# EAGLE design UBTB_original (EAGLE 9.4.2)
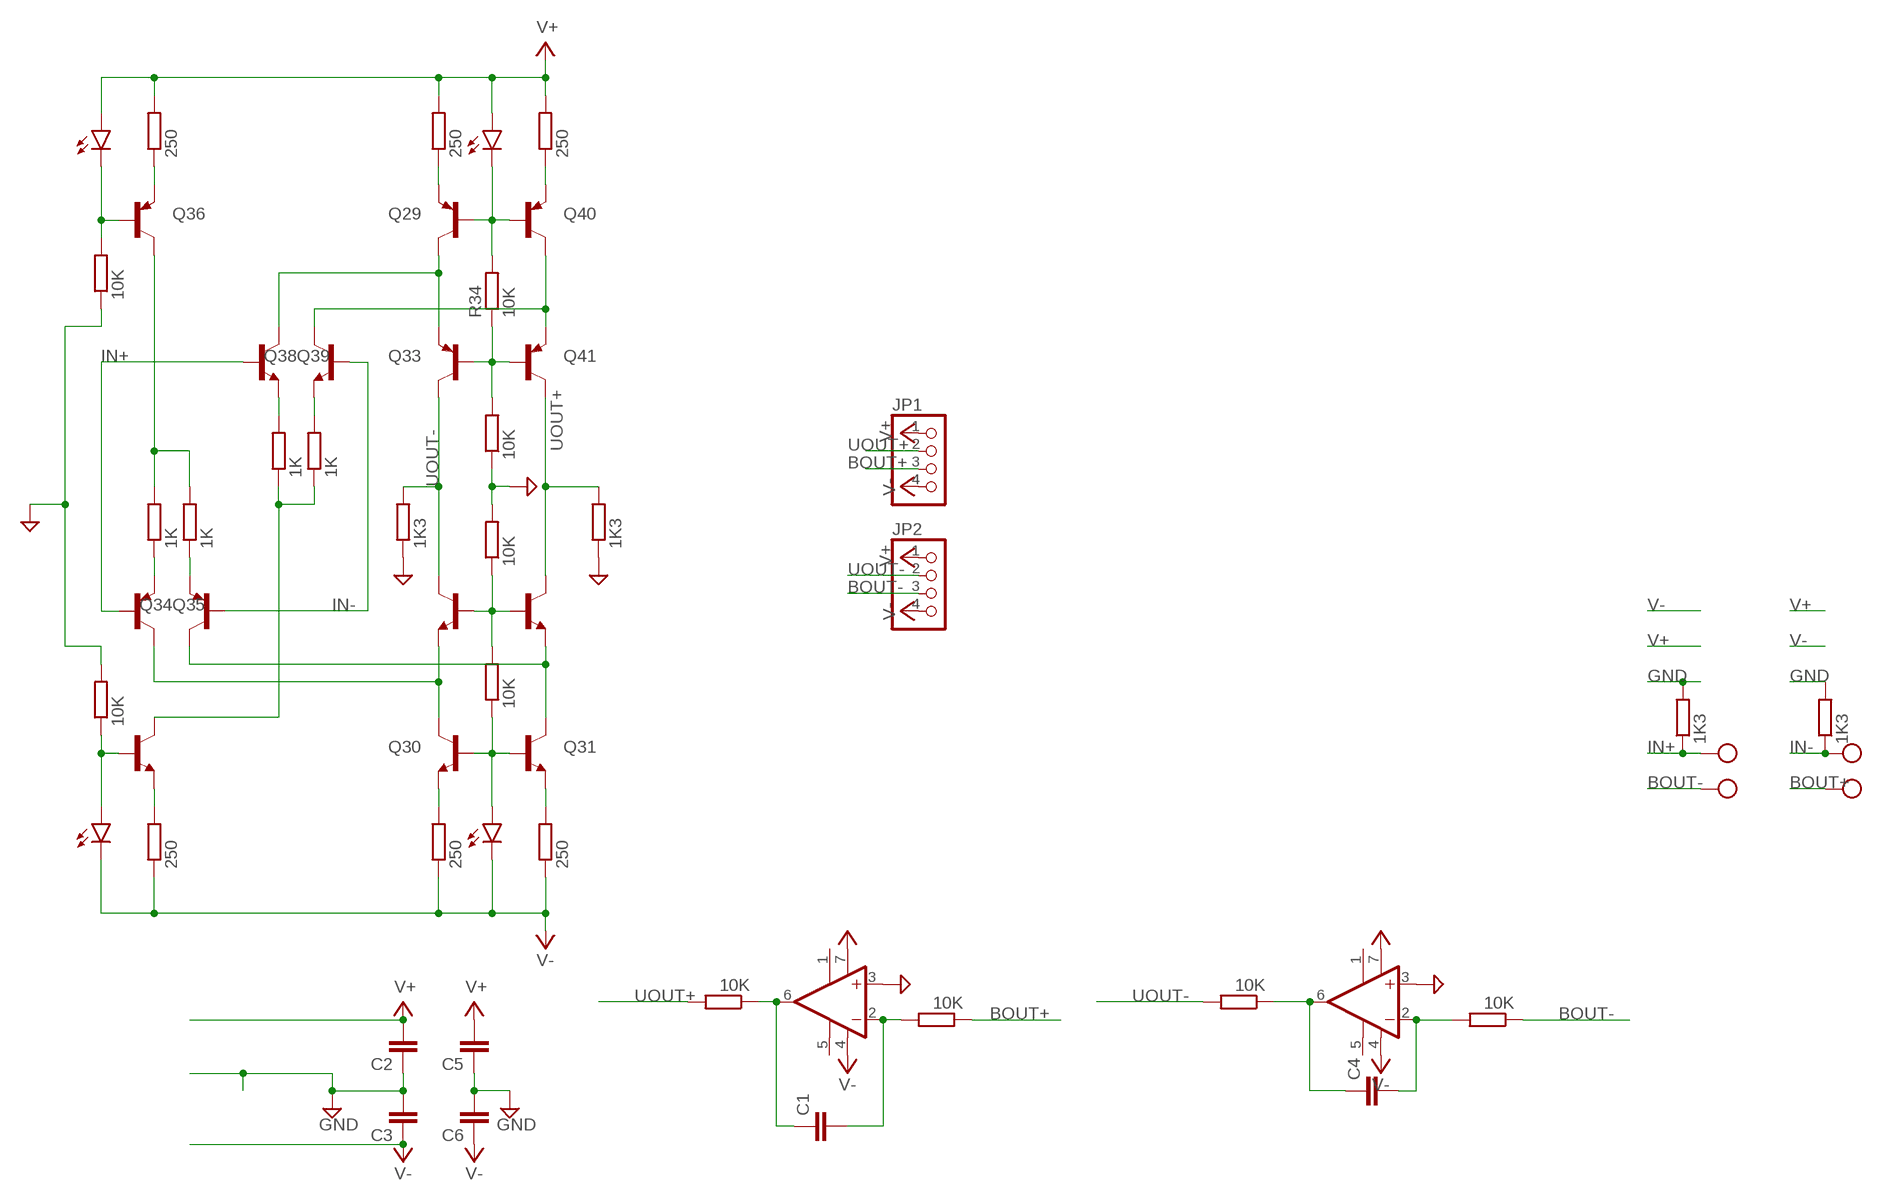
[diagram p0: schematic, sheet 1]

## Parts
C1  C-EUC1206  [C1206]
C2  C-EUC0805  [C0805]
C3  C-EUC0805  [C0805]
C4  C-EUC1206  [C1206]
C5  C-EUC0805  [C0805]
C6  C-EUC0805  [C0805]
IC1  OPA627U  [SO08]
IC2  OPA627U  [SO08]
JP1  PINHD-1X4  [1X04]
JP2  PINHD-1X4  [1X04]
LED1  LEDCHIPLED_1206  [CHIPLED_1206]
LED2  LEDCHIPLED_1206  [CHIPLED_1206]
LED3  LEDCHIPLED_1206  [CHIPLED_1206]
LED4  LEDCHIPLED_1206  [CHIPLED_1206]
Q26  BC847CSMD  [SOT23]
Q29  BC857CSMD  [SOT23-BEC]
Q30  BC847CSMD  [SOT23]
Q31  BC847CSMD  [SOT23]
Q32  BC847CSMD  [SOT23]
Q33  BC857CSMD  [SOT23-BEC]
Q34  BC857CSMD  [SOT23-BEC]
Q35  BC857CSMD  [SOT23-BEC]
Q36  BC857CSMD  [SOT23-BEC]
Q37  BC847CSMD  [SOT23]
Q38  BC847CSMD  [SOT23]
Q39  BC847CSMD  [SOT23]
Q40  BC857CSMD  [SOT23-BEC]
Q41  BC857CSMD  [SOT23-BEC]
R1  1K3  R-EU_MELF0204W  [MINI_MELF-0204W]
R2  1K3  R-EU_MELF0204W  [MINI_MELF-0204W]
R16  10K  R-EU_MELF0204W  [MINI_MELF-0204W]
R17  10K  R-EU_MELF0204W  [MINI_MELF-0204W]
R22  250  R-EU_MELF0204W  [MINI_MELF-0204W]
R23  250  R-EU_MELF0204W  [MINI_MELF-0204W]
R29  10K  R-EU_MELF0204W  [MINI_MELF-0204W]
R32  10K  R-EU_MELF0204W  [MINI_MELF-0204W]
R33  10K  R-EU_MELF0204W  [MINI_MELF-0204W]
R34  10K  R-EU_MELF0204W  [MINI_MELF-0204W]
R35  250  R-EU_MELF0204W  [MINI_MELF-0204W]
R36  250  R-EU_MELF0204W  [MINI_MELF-0204W]
R37  1K3  R-EU_MELF0204W  [MINI_MELF-0204W]
R38  1K3  R-EU_MELF0204W  [MINI_MELF-0204W]
R39  1K  R-EU_MELF0204W  [MINI_MELF-0204W]
R40  1K  R-EU_MELF0204W  [MINI_MELF-0204W]
R41  1K  R-EU_MELF0204W  [MINI_MELF-0204W]
R42  1K  R-EU_MELF0204W  [MINI_MELF-0204W]
R43  250  R-EU_MELF0204W  [MINI_MELF-0204W]
R44  250  R-EU_MELF0204W  [MINI_MELF-0204W]
R45  10K  R-EU_MELF0204W  [MINI_MELF-0204W]
R46  10K  R-EU_MELF0204W  [MINI_MELF-0204W]
R48  10K  R-EU_MELF0204W  [MINI_MELF-0204W]
R51  10K  R-EU_MELF0204W  [MINI_MELF-0204W]
X3  CON-PHOENIX-508_MKDSN1,5/2-5,08  [CON-PHOENIX-508_MKDSN1,5/2-5,08]
X4  CON-PHOENIX-508_MKDSN1,5/2-5,08  [CON-PHOENIX-508_MKDSN1,5/2-5,08]

## Nets
BOUT+: JP1.3 R17.1 X4.2
BOUT-: JP2.3 R48.1 X3.2
GND: C2.1 C3.2 C5.1 C6.2 IC1.3(+IN) IC2.3(+IN) R1.2 R2.2 R32.2 R33.1 R37.1 R38.1 R45.1 R46.2
IN+: Q35.B Q39.1(B) R1.1 X3.1
IN-: Q34.B Q38.1(B) R2.1 X4.1
N$1: C4.1 IC2.6(OUT) R51.1
N$3: C4.2 IC2.2(-IN) R48.2
N$19: C1.2 IC1.2(-IN) R17.2
N$22: C1.1 IC1.6(OUT) R16.1
N$93: Q30.2(E) R22.2
N$94: Q31.2(E) R23.2
N$95: Q31.3(C) Q32.2(E) Q34.C
N$96: Q30.3(C) Q35.C Q37.2(E)
N$97: LED1.A Q30.1(B) Q31.1(B) R29.1
N$98: Q32.1(B) Q37.1(B) R29.2 R32.1
N$101: Q33.B Q41.B R33.2 R34.1
N$102: Q29.C Q33.E Q39.3(C)
N$103: LED2.C Q29.B Q40.B R34.2
N$104: Q38.3(C) Q40.C Q41.E
N$105: Q29.E R35.1
N$106: Q40.E R36.1
N$108: LED3.C Q36.B R45.2
N$109: Q36.E R43.1
N$110: Q36.C R41.2 R42.2
N$111: Q34.E R42.1
N$112: Q35.E R41.1
N$115: Q39.2(E) R39.2
N$116: Q38.2(E) R40.2
N$117: Q26.3(C) R39.1 R40.1
N$118: Q26.2(E) R44.2
N$119: LED4.A Q26.1(B) R46.1
UOUT+: JP1.2 Q32.3(C) Q41.C R16.2 R38.2
UOUT-: JP2.2 Q33.C Q37.3(C) R37.2 R51.2
V+: C2.2 C5.2 IC1.7(V+) IC2.7(V+) JP1.1 JP2.1 LED2.A LED3.A R35.2 R36.2 R43.2
V-: C3.1 C6.1 IC1.4(V-) IC2.4(V-) JP1.4 JP2.4 LED1.C LED4.C R22.1 R23.1 R44.1
Unconnected: IC1.1(TRIM1) IC1.5(TRIM2) IC2.1(TRIM1) IC2.5(TRIM2)

## Library data of the parts
C1-C6 = Vwvwbg:C-EU: CAPACITOR, European symbol
IC1 IC2 = burr-brown:OPA627: Difet(R) Operational Amplifiers Precision, High-Speed; MF: TEXAS INSTRUMENTS; MPN: OPA627AU; OC_FARNELL: 1207067; OC_NEWARK: 30C4516
JP1 JP2 = pinhead:PINHD-1X4: PIN HEADER
LED1-LED3 = led:LED: LED OSRAM: - CHIPLED LG R971, LG N971, LY N971, LG Q971, LY Q971, LO R971, LY R971 LH N974, LH R974 LS Q976, LO Q976, LY Q976 LO Q996 - Hyper CHIPLED LW Q18S LB Q993, LB Q99A, LB R99A - SideLED LS A670, LO A670, LY A670, LG A670, LP A670 LB A673, LV A673, LT A673, LW A673 LH A674 LY A675 LS A676, LA A676, LO A676, LY A676, LW A676 LS A679, LY A679, LG A679 - Hyper Micro SIDELED® LS Y876, LA Y876, LO Y876, LY Y876 LT Y87S - SmartLED LW L88C, LW L88S LB L89C, LB L89S, LG L890 LS L89K, LO L89K, LY L89K LS L896, LA L896, LO L896, LY L896 - TOPLED LS T670, LO T670, LY T670, LG T670, LP T670 LSG T670, LSP T670, LSY T670, LOP T670, LYG T670 LG T671, LOG T671, LSG T671 LB T673, LV T673, LT T673, LW T673 LH T674 LS T676, LA T676, LO T676, LY T676, LB T676, LH T676, LSB T676, LW T676 LB T67C, LV T67C, LT T67C, LS T67K, LO T67K, LY T67K, LW E67C LS E67B, LA E67B, LO E67B, LY E67B, LB E67C, LV E67C, LT E67C LW T67C LS T679, LY T679, LG T679 LS T770, LO T770, LY T770, LG T770, LP T770 LB T773, LV T773, LT T773, LW T773 LH T774 LS E675, LA E675, LY E675, LS T675 LS T776, LA T776, LO T776, LY T776, LB T776 LHGB T686 LT T68C, LB T68C - Hyper Mini TOPLED® LB M676 - Mini TOPLED Santana® LG M470 LS M47K, LO M47K, LY M47K Source: http://www.osram.convergy.de LUXEON: - LUMILED® LXK2-PW12-R00, LXK2-PW12-S00, LXK2-PW14-U00, LXK2-PW14-V00 LXK2-PM12-R00, LXK2-PM12-S00, LXK2-PM14-U00 LXK2-PE12-Q00, LXK2-PE12-R00, LXK2-PE12-S00, LXK2-PE14-T00, LXK2-PE14-U00 LXK2-PB12-K00, LXK2-PB12-L00, LXK2-PB12-M00, LXK2-PB14-N00, LXK2-PB14-P00, LXK2-PB14-Q00 LXK2-PR12-L00, LXK2-PR12-M00, LXK2-PR14-Q00, LXK2-PR14-R00 LXK2-PD12-Q00, LXK2-PD12-R00, LXK2-PD12-S00 LXK2-PH12-R00, LXK2-PH12-S00 LXK2-PL12-P00, LXK2-PL12-Q00, LXK2-PL12-R00 Source: www.luxeon.com KINGBRIGHT: KA-3528ASYC Source: www.kingbright.com
LED4 = led:LED: LED OSRAM: - CHIPLED LG R971, LG N971, LY N971, LG Q971, LY Q971, LO R971, LY R971 LH N974, LH R974 LS Q976, LO Q976, LY Q976 LO Q996 - Hyper CHIPLED LW Q18S LB Q993, LB Q99A, LB R99A - SideLED LS A670, LO A670, LY A670, LG A670, LP A670 LB A673, LV A673, LT A673, LW A673 LH A674 LY A675 LS A676, LA A676, LO A676, LY A676, LW A676 LS A679, LY A679, LG A679 - Hyper Micro SIDELED® LS Y876, LA Y876, LO Y876, LY Y876 LT Y87S - SmartLED LW L88C, LW L88S LB L89C, LB L89S, LG L890 LS L89K, LO L89K, LY L89K LS L896, LA L896, LO L896, LY L896 - TOPLED LS T670, LO T670, LY T670, LG T670, LP T670 LSG T670, LSP T670, LSY T670, LOP T670, LYG T670 LG T671, LOG T671, LSG T671 LB T673, LV T673, LT T673, LW T673 LH T674 LS T676, LA T676, LO T676, LY T676, LB T676, LH T676, LSB T676, LW T676 LB T67C, LV T67C, LT T67C, LS T67K, LO T67K, LY T67K, LW E67C LS E67B, LA E67B, LO E67B, LY E67B, LB E67C, LV E67C, LT E67C LW T67C LS T679, LY T679, LG T679 LS T770, LO T770, LY T770, LG T770, LP T770 LB T773, LV T773, LT T773, LW T773 LH T774 LS E675, LA E675, LY E675, LS T675 LS T776, LA T776, LO T776, LY T776, LB T776 LHGB T686 LT T68C, LB T68C - Hyper Mini TOPLED® LB M676 - Mini TOPLED Santana® LG M470 LS M47K, LO M47K, LY M47K Source: http://www.osram.convergy.de LUXEON: - LUMILED® LXK2-PW12-R00, LXK2-PW12-S00, LXK2-PW14-U00, LXK2-PW14-V00 LXK2-PM12-R00, LXK2-PM12-S00, LXK2-PM14-U00 LXK2-PE12-Q00, LXK2-PE12-R00, LXK2-PE12-S00, LXK2-PE14-T00, LXK2-PE14-U00 LXK2-PB12-K00, LXK2-PB12-L00, LXK2-PB12-M00, LXK2-PB14-N00, LXK2-PB14-P00, LXK2-PB14-Q00 LXK2-PR12-L00, LXK2-PR12-M00, LXK2-PR14-Q00, LXK2-PR14-R00 LXK2-PD12-Q00, LXK2-PD12-R00, LXK2-PD12-S00 LXK2-PH12-R00, LXK2-PH12-S00 LXK2-PL12-P00, LXK2-PL12-Q00, LXK2-PL12-R00 Source: www.luxeon.com KINGBRIGHT: KA-3528ASYC Source: www.kingbright.com; SPICEPREFIX: D
Q26 Q30-Q32 Q37-Q39 = transistor-npn:BC847*: NPN Transistor; SPICEPREFIX: Q
Q29 Q33-Q36 Q40 Q41 = transistor-pnp:BC857*: PNP Transistror; SPICEPREFIX: Q
R1 R2 R16 R17 R22 R23 R29 R32-R43 R45 R46 R48 R51 = Vwvwbg:R-EU_: RESISTOR, European symbol
R44 = Vwvwbg:R-EU_: RESISTOR, European symbol; SPICEPREFIX: R
X3 X4 = Vwvwbg:CON-PHOENIX-508_MKDSN1,5/2-5,08: MKDSN 1,5/ 2-5,08 Printklemme Nennstrom: 13,5 A Nennspannung: 250 V Rastermaß: 5,08 mm Polzahl: 2 Anschlussart: Schraubanschluss Montage: Löten Anschlussrichtung Leiter/Platine: 0 ° Artikelnummer: 1729128 Source: http://eshop.phoenixcontact.com .. 1729128.pdf

## Board
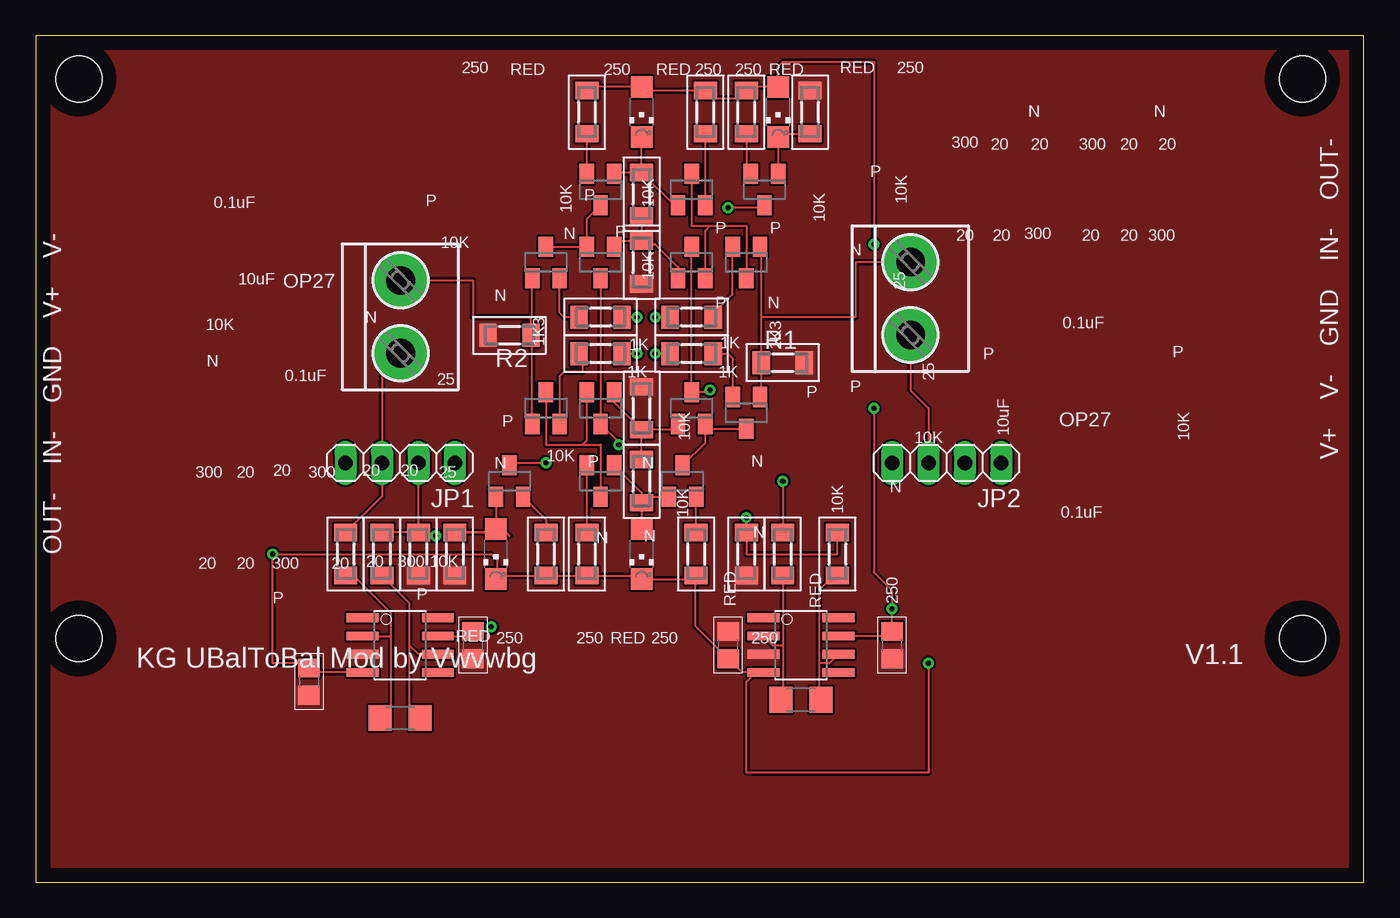
[diagram p1: board, top side]
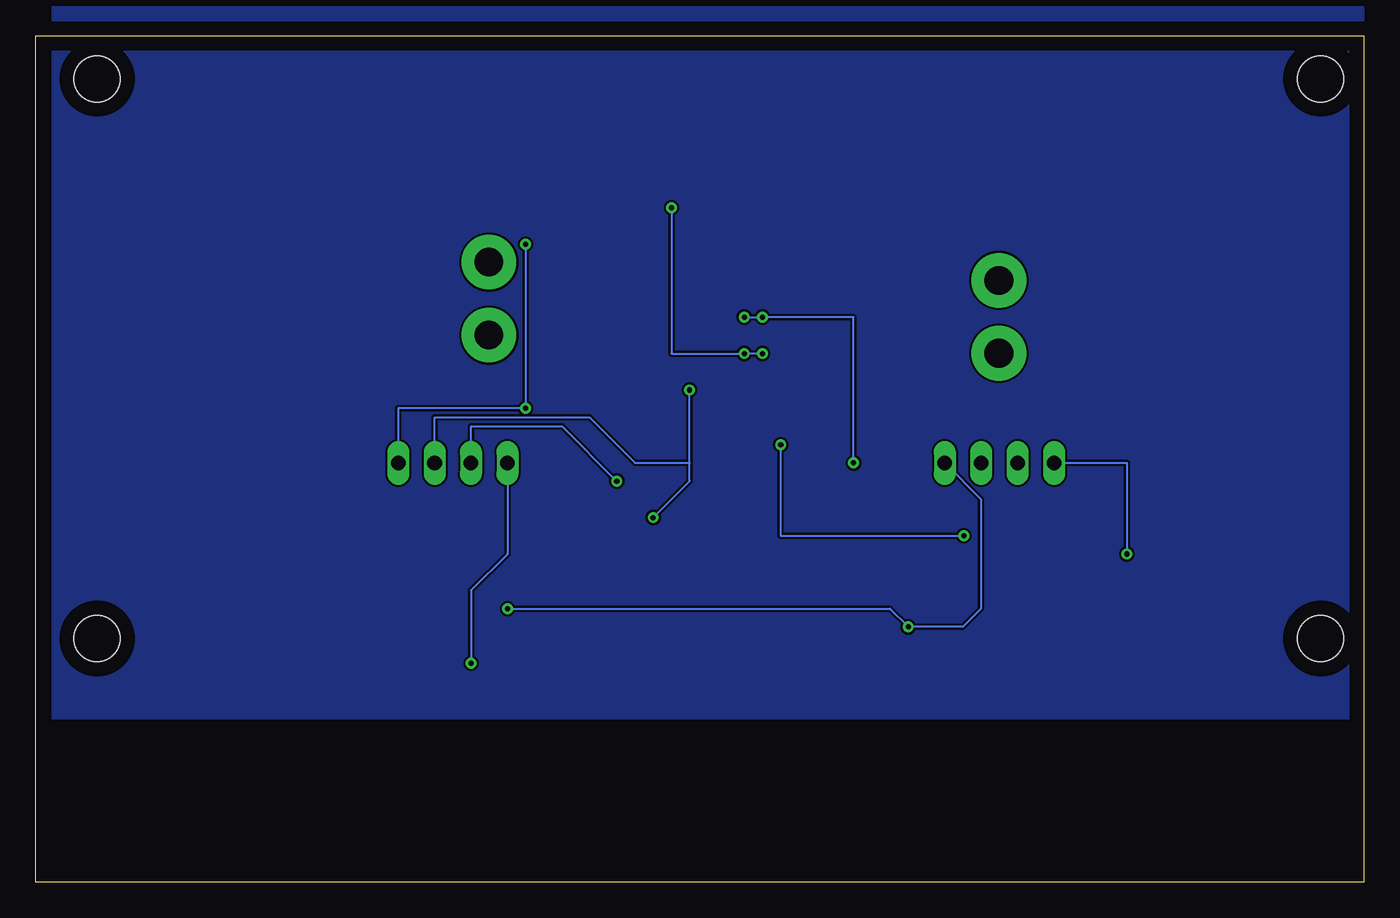
[diagram p2: board, bottom side, seen from below]

Size 92.57 x 58.97 mm. Coordinates in mm from the lower left corner, seen from the top.
Outline: 0,0 92.57,0 92.57,58.97 0,58.97 0,0
Copper layers (1*16): Top 0.035mm / dielectric 1.5mm / Bottom 0.035mm
Design rules "default *": minimum track width 6mil, minimum drill 0.35mm, track to track 6mil, track to pad 6mil, pad to pad 6mil, via to via 6mil, smd to smd 6mil, copper to edge 40mil, drill to drill 6mil, minimum pad ring 10mil, minimum via ring 8mil, stop-mask expansion 4mil, vias tented up to drill 0.35mm, thermal gap 10mil
Holes 3.2 mm at 3,55.97 88.3,16.97 88.3,55.97 3,16.97

### Footprints (pad centres in the part's own frame; a part is rotated, then mirrored left to right if it is on the bottom)
C1206 = smd 1.6 x 1.8: 1 -1.4,0; 2 1.4,0
C0805 = smd 1.3 x 1.5: 1 -0.95,0; 2 0.95,0
SO08 = smd 0.61 x 2.21: 1 -1.905,-2.616; 2 -0.635,-2.616; 3 0.635,-2.616; 4 1.905,-2.616; 5 1.905,2.616; 6 0.635,2.616; 7 -0.635,2.616; 8 -1.905,2.616
1X04 = drill 1.016 long: 1 -3.81,0; 2 -1.27,0; 3 1.27,0; 4 3.81,0
CHIPLED_1206 = smd 1.5 x 1.5: A 0,-1.75; C 0,1.75
SOT23 = smd 1 x 1.4: 1 -0.95,-1.1; 2 0.95,-1.1; 3 0,1.1
SOT23-BEC = smd 1 x 1.4: B -0.95,-1.1; C 0,1.1; E 0.95,-1.1
MINI_MELF-0204W = smd 1.2 x 1.6: 1 -1.5,0; 2 1.5,0
CON-PHOENIX-508_MKDSN1,5/2-5,08 = drill 2 pad 3.81: 1 -2.561,0.025; 2 2.519,0.025

### Placement (x,y rotation side)
C1  25.4,11.43 180 top
C2  59.69,16.51 90 top
C3  19.05,13.97 270 top
C4  53.34,12.7 180 top
C5  30.48,16.51 90 top
C6  48.26,16.51 90 top
IC1  25.4,16.51 270 top
IC2  53.34,16.51 270 top
JP1  25.4,29.21 180 top
JP2  63.5,29.21 180 top
LED1  42.23,22.86 180 top
LED2  42.23,53.66 180 top
LED3  51.75,53.66 180 top
LED4  32.07,22.86 180 top
Q26  33.02,27.94 0 top
Q29  45.72,48.26 0 top
Q30  45.09,27.94 0 top
Q31  39.37,27.94 180 top
Q32  39.37,33.02 180 top
Q33  45.72,43.18 0 top
Q34  35.56,33.02 0 top
Q35  49.53,32.7 180 top
Q36  50.8,48.26 180 top
Q37  45.72,33.02 0 top
Q38  35.56,43.18 0 top
Q39  49.53,43.18 180 top
Q40  39.37,48.26 180 top
Q41  39.37,43.18 180 top
R1  52.07,36.2 0 top
R2  33.02,38.1 180 top
R16  24.13,22.86 90 top
R17  21.59,22.86 270 top
R22  46.04,22.86 90 top
R23  38.42,22.86 90 top
R29  42.23,27.94 90 top
R32  42.23,33.02 90 top
R33  42.23,43.18 90 top
R34  42.23,47.94 90 top
R35  46.67,53.66 90 top
R36  38.42,53.66 90 top
R37  49.53,22.86 90 top
R38  26.67,22.86 90 top
R39  45.72,39.37 0 top
R40  39.37,39.37 180 top
R41  45.72,36.83 180 top
R42  39.37,36.83 0 top
R43  49.53,53.66 90 top
R44  35.56,22.86 90 top
R45  53.98,53.66 270 top
R46  29.21,22.86 270 top
R48  52.07,22.86 270 top
R51  55.88,22.86 90 top
X3  60.96,40.64 270 top
X4  25.4,39.37 270 top

### Tracks (layer width: path | path; a pad name or v marks a point on that pad's centre or on a via)
BOUT+
  Top 0.152: R17.1 24.13,26.9 JP1.3 24.13,35.56 X4.2
BOUT-  (via drill 0.35)
  Top 0.152: X3.2 60.98,34.27 62.23,33.02 JP2.3 | v52.07,27.94 R48.1
  Bottom 0.152: 62.23,30.48 JP2.3 62.23,31.75 55.88,31.75 v52.07,27.94
GND
  pour Bottom: 0,60.96 91.44,60.96 91.44,11.43 0,11.43
  pour Top (no thermals): -1.27,64.77 92.71,64.77 92.71,-1.27 -1.27,-1.27
IN+
  Top 0.152: Q39.1 50.57,44.19 50.57,39.37 | 50.57,39.37 R1.1 50.57,33.89 Q35.B | X3.1 60.96,43.18 57.15,43.18 57.15,39.37 50.57,39.37
IN-
  Top 0.152: X4.1 30.48,41.93 30.48,39.37 34.52,39.37 | Q38.1 34.61,39.37 34.52,39.37 | 34.52,39.37 R2.1 34.61,38.1 Q34.B
N$1
  Top 0.152: R51.1 55.65,21.36 54.61,20.32 54.61,15.24 | 54.61,15.24 54.61,12.83 C4.1 | IC2.6 55.32,15.24 54.61,15.24
N$3
  Top 0.152: C4.2 52.07,12.83 52.07,16.51 | R48.2 52.07,16.51 | IC2.2 51.36,16.51 52.07,16.51
N$19
  Top 0.152: C1.2 24.77,12.2 24.77,17.14 | 24.77,17.14 24.77,18.73 22.14,21.36 R17.2 | IC1.2 24.77,17.14
N$22
  Top 0.152: R16.1 26.04,19.46 26.04,16.51 | C1.1 26.04,12.2 26.04,16.51 | IC1.6 26.67,15.88 26.04,16.51
N$93
  Top 0.152: R22.2 Q30.2
N$94
  Top 0.152: R23.2 Q31.2
N$95
  Top 0.152: Q34.C 35.56,30.48 38.1,30.48 | 38.1,30.48 38.42,30.8 Q32.2 | 38.1,30.48 39.37,30.48 Q31.3
N$96
  Top 0.152: Q30.3 46.67,30.62 Q37.2 46.99,31.6 Q35.C
N$97
  Top 0.152: Q31.1 42.23,27.13 R29.1 | R29.1 LED1.A | R29.1 42.63,26.84 Q30.1
N$98
  Top 0.152: Q37.1 44.37,31.52 R32.1 | R29.2 R32.1 | R32.1 40.32,33.43 Q32.1
N$101
  Top 0.152: R33.2 42.46,44.45 43.18,44.45 44.77,42.86 Q33.B | R34.1 R33.2 | Q41.B 40.72,44.68 R33.2
N$102
  Top 0.152: Q29.C 45.72,45.72 46.99,45.72 | 46.99,45.72 49.53,45.72 Q39.3 | Q33.E 46.67,45.4 46.99,45.72
N$103
  Top 0.152: R34.2 40.4,49.44 Q40.B | R34.2 LED2.C | R34.2 44.51,47.16 Q29.B
N$104
  Top 0.152: Q38.3 Q41.E 38.42,46.21 Q40.C
N$105
  Top 0.152: Q29.E R35.1
N$106
  Top 0.152: Q40.E R36.1
N$108
  Top 0.152: R45.2 52,52.16 LED3.C Q36.B
N$109
  Top 0.152: R43.1 49.53,49.68 Q36.E
N$110  (via drill 0.35)
  Top 0.152: Q36.C 50.63,46.99 v48.26,46.99 | v43.18,36.83 R41.2 | R42.2 v41.91,36.83
  Bottom 0.152: v48.26,46.99 48.26,36.83 v43.18,36.83 v41.91,36.83
N$111
  Top 0.152: R42.1 38.1,36.6 38.1,35.56 36.83,35.56 36.51,35.24 Q34.E
N$112
  Top 0.152: R41.1 48.26,36.83 48.58,36.51 Q35.E
N$115
  Top 0.152: R39.2 47.22,39.6 48.58,40.96 Q39.2
N$116
  Top 0.152: R40.2 36.83,39.37 36.51,39.69 Q38.2
N$117  (via drill 0.35)
  Top 0.152: R39.1 v43.18,39.37 | v41.91,39.37 R40.1 | Q26.3 33.19,29.21 v35.56,29.21
  Bottom 0.152: v43.18,39.37 v41.91,39.37 35.56,39.37 v35.56,29.21
N$118
  Top 0.152: Q26.2 35.56,25.25 R44.2
N$119
  Top 0.152: Q26.1 LED4.A 31.82,24.36 R46.1 32.79,24.36 33.02,24.13
UOUT+  (via drill 0.35)
  Top 0.152: Q41.C Q32.3 40.64,30.65 v40.64,30.48 | v27.88,24.13 26.9,24.13 R38.2 | R38.2 R16.2 | R38.2 JP1.2
  Bottom 0.152: v40.64,30.48 40.64,24.13 v27.88,24.13
UOUT-  (via drill 0.35)
  Top 0.152: v49.53,25.4 R37.2 49.53,22.86 55.88,22.86 R51.2 | v46.99,34.29 46.82,34.12 Q37.3 Q33.C
  Bottom 0.152: v49.53,25.4 46.99,27.94 46.99,29.21 | 46.99,29.21 v46.99,34.29 | JP2.2 64.77,32.38 53.98,32.38 50.8,29.21 46.99,29.21
V+  (via drill 0.35)
  Top 0.152: 46.19,55.41 46.67,54.93 | R36.2 38.67,55.41 LED2.A 42.48,55.16 R35.2 46.67,54.93 | IC1.7 30.16,17.14 C5.2 31.43,17.46 v31.75,17.78 | IC2.7 59.38,17.14 C2.2 v59.69,19.05 59.69,20.32 58.42,21.59 v58.42,33.02 | v58.42,44.45 58.42,57.15 52.07,57.15 51.75,56.83 LED3.A 49.78,55.41 R43.2 48.98,54.61 46.99,54.61 46.67,54.93
  Bottom 0.152: v59.69,19.05 33.02,19.05 v31.75,17.78 27.94,17.78 26.67,19.05 26.67,26.67 JP1.1 | v58.42,44.45 v58.42,33.02 67.31,33.02 JP2.1
V-  (via drill 0.35)
  Top 0.152: IC1.4 19.36,14.61 C3.1 18.73,15.24 16.51,15.24 v16.51,22.86 31.75,22.86 32.15,22.46 32.15,21.19 | LED4.C 32.15,21.19 | 32.15,21.19 32.32,21.36 R44.1 R23.1 41.98,21.36 LED1.C 45.79,21.11 45.99,21.32 | 45.99,21.32 R22.1 | v62.23,15.24 62.23,7.62 49.53,7.62 49.53,13.97 50.16,14.61 IC2.4 49.22,14.61 C6.1 45.99,17.83 45.99,21.32
  Bottom 0.152: JP2.4 59.69,22.86 62.23,20.32 v62.23,15.24 | JP1.4 16.51,29.21 v16.51,22.86

### Text on the board
tPlace: 250 | RED | 250 | RED | 250 | 250 | RED | RED | 250 | N | N | 300 | 20 | 20 | 300 | 20 | 20 | P | P | 10K | P | 10K | 10K | 0.1uF | 10K | P | P | 10K | N | P | 20 | 20 | 300 | 20 | 20 | 300 | N | 10K | 10uF | OP27 | 25 | N | V+ V- GND IN- OUT- | P | N | 10K | N | 0.1uF | 1K3 | 1K | 1K3 | 1K | P | P | N | 1K | 1K | 25 | 0.1uF | 25 | P | OUT- IN- GND V+ V- | P | P | 10K | 10uF | OP27 | 10K | 10K | 10K | 300 | 20 | 20 | 300 | 20 | 20 | 25 | N | P | N | N | N | 10K | 10K | 0.1uF | N | N | N | 20 | 20 | 300 | 20 | 20 | 300 | 10K | P | P | RED | RED | 250 | RED | 250 | 250 | RED | 250 | 250 | KG UBalToBal Mod by Vwvwbg | V1.1